# Altium schematic sheet 100_POWER_AND LOADS.SchDoc
size A; SheetNumber: 2; SheetTotal: 4
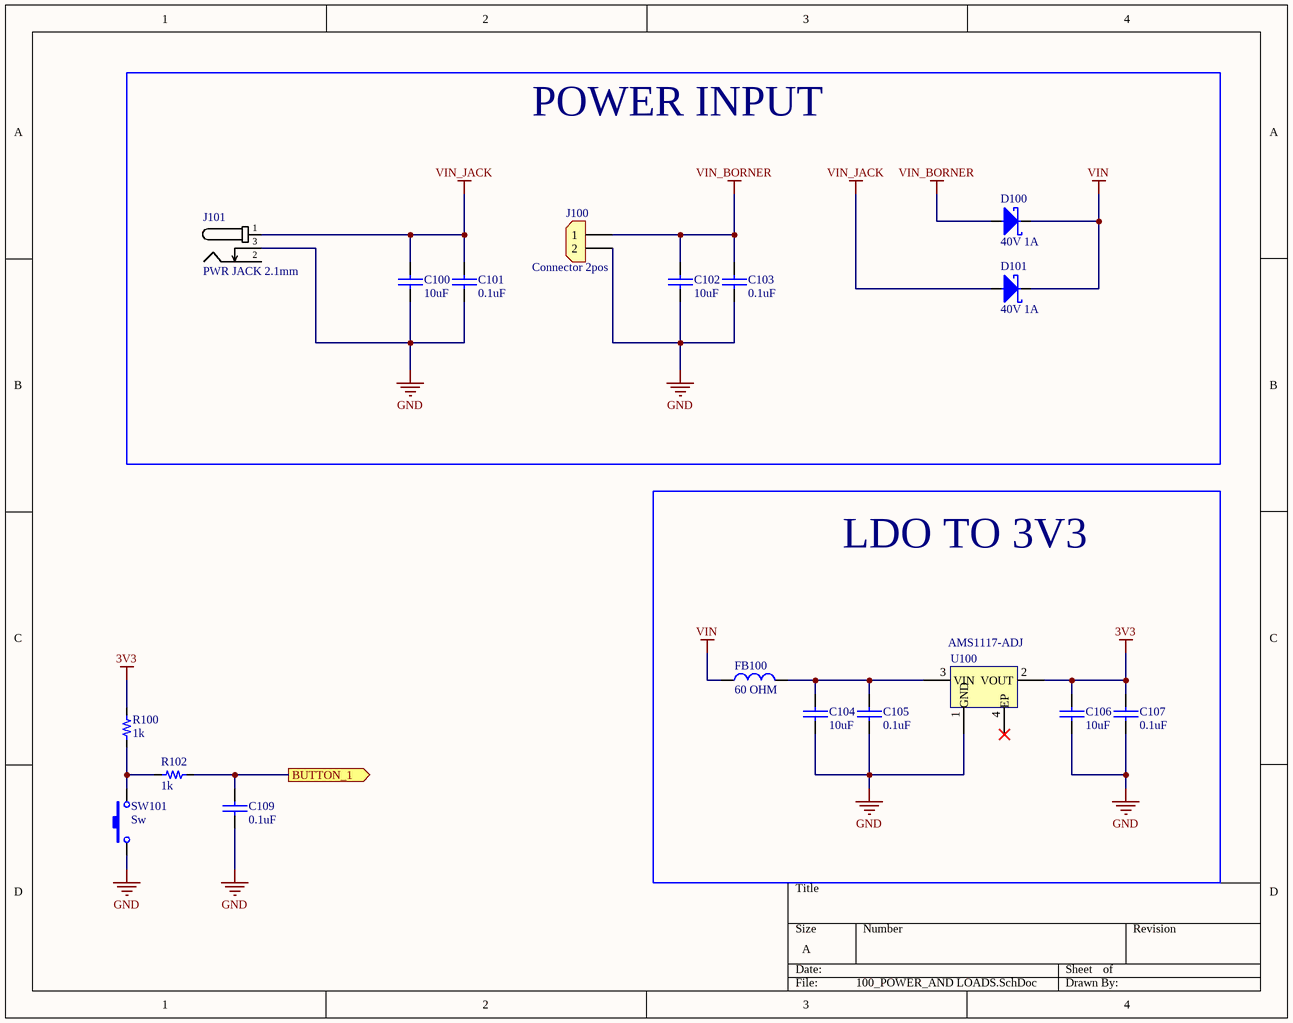
[diagram p0: 100_POWER_AND LOADS.SchDoc]

## Parts
C100  value 10uF  [0603_cap]  (hidden comment: 10uF 10V)
C101  value 0.1uF  [0603_cap]  (hidden comment: 0.1uF 50V)
C102  value 10uF  [0603_cap]  (hidden comment: 10uF 10V)
C103  value 0.1uF  [0603_cap]  (hidden comment: 0.1uF 50V)
C104  value 10uF  [0603_cap]  (hidden comment: 10uF 10V)
C105  value 0.1uF  [0603_cap]  (hidden comment: 0.1uF 50V)
C106  value 10uF  [0603_cap]  (hidden comment: 10uF 10V)
C107  value 0.1uF  [0603_cap]  (hidden comment: 0.1uF 50V)
C109  value 0.1uF  [0603_cap]  (hidden comment: 0.1uF 50V)
D100  40V 1A  [SOD_123]
D101  40V 1A  [SOD_123]
FB100  value 60 OHM  [0603_fb]  (hidden comment: 60OHM 2A)
J100  Connector 2pos  [CON_2x1_TH_5MM]
J101  PWR JACK 2.1mm  [CON_POWER_BARREL_2.1MM_3CONN]
R100  value 1k  [0603_res]  (hidden comment: 1k 1/10W)
R102  value 1k  [0603_res]  (hidden comment: 1k 1/10W)
SW101  Sw  [Sw_PUSH_4.5x4.5x5mm]
U100  AMS1117-ADJ  [SOT_223]

## Blocks framed on the sheet
POWER INPUT: C100-C103 D100 D101 J100 J101
LDO TO 3V3: C104-C107 FB100 U100

## Ports
BUTTON_1 (out, see Main[2B], 000_MCU[2C])

## Nets
3V3: C106.1 C107.1 R100.1 U100.2(VOUT)
GND: C100.2 C101.2 C102.2 C103.2 C104.2 C105.2 C106.2 C107.2 C109.2 J100.2 J101.3 SW101.1 U100.1(GND)
VIN: D100.1 D101.1 FB100.1
VIN_BORNER: C102.1 C103.1 D100.2 J100.1
VIN_JACK: C100.1 C101.1 D101.2 J101.1
BUTTON_1: C109.1 R102.2 ; port BUTTON_1
NetC104_1: C104.1 C105.1 FB100.2 U100.3(VIN)
NetR100_2: R100.2 R102.1 SW101.2

Not connected (* = marked no-connect by the designer): J101 2; U100 4(EP)*

## Library data of the parts
C100 C102 C104 C106 = Cap_10uF_0603_10V: 10V 10uF X5R ±10% 0603 Multilayer Ceramic Capacitors MLCC - SMD/SMT ROHS; Manufacturer: CCTC; Manufacturer Part Number: TCC0603X5R106K100CT; Supplier 1: LCSC; Supplier Part Number 1: C380314; ComponentLink1Description: LCSC; ComponentLink1URL: https://www.lcsc.com/product-detail/Multilayer-Ceramic-Capacitors-MLCC-SMD-SMT_CCTC-TCC0603X5R106K100CT_C380314.html
C101 C103 C105 C107 = Cap_0.1uF_0603_50V: 50V 100nF Y5V -20%~+80% 0603 Multilayer Ceramic Capacitors MLCC - SMD/SMT ROHS; Manufacturer: Walsin Tech Corp; Manufacturer Part Number: 0603F104Z500CT; Supplier 1: LCSC; Supplier Part Number 1: C83060; ComponentLink1Description: LCSC; ComponentLink1URL: https://www.lcsc.com/product-detail/Multilayer-Ceramic-Capacitors-MLCC-SMD-SMT_Walsin-Tech-Corp-0603F104Z500CT_C83060.html
C109 = Cap_0.1uF_0603_50V: 50V 100nF Y5V -20%~+80% 0603 Multilayer Ceramic Capacitors MLCC - SMD/SMT ROHS; Manufacturer: Walsin Tech Corp; Manufacturer Part Number: 0603F104Z500CT; Usage: NM; Supplier 1: LCSC; Supplier Part Number 1: C83060; ComponentLink1Description: LCSC; ComponentLink1URL: https://www.lcsc.com/product-detail/Multilayer-Ceramic-Capacitors-MLCC-SMD-SMT_Walsin-Tech-Corp-0603F104Z500CT_C83060.html
D100 D101 = D_Schottky_40V_1A_SOD_123F: DIODE SCHOTTKY 40V 1A SOD123F; Manufacturer: Shanghai Prisemi Elec; Manufacturer Part Number: PSBD1DF40V1H; Supplier 1: LCSC; Supplier Part Number 1: C110730; ComponentLink1Description: LCSC; ComponentLink1URL: https://www.lcsc.com/product-detail/Switching-Diode_Shanghai-Prisemi-Elec-PSBD1DF40V1H_C110730.html
FB100 = FB_60_0603_2A: 2A 1 100mΩ 60Ω@100MHz ±25% 0603 Ferrite Beads ROHS; Manufacturer: TAI-TECH; Manufacturer Part Number: HCB1608KF-600T20; ComponentLink1Description: LCSC; ComponentLink1URL: https://www.lcsc.com/product-detail/Ferrite-Beads_TAI-TECH-HCB1608KF-600T20_C369516.html; Supplier 1: LCSC; Supplier Part Number 1: C369516
J100 = Con_2x1_TH_5mm: 2POS 5MM; Manufacturer: JILN; Manufacturer Part Number: JL126-50002G01; Supplier 1: LCSC; Supplier Part Number 1: C394556; ComponentLink1Description: Digi-Key; ComponentLink1URL: https://www.lcsc.com/product-detail/Screw-terminal_JILN-JL126-50002G01_C394556.html
J101 = Con_Power_Jack_2.1mm_3pins: CONN PWR JACK 2X5.5MM SOLDER; Manufacturer: HCTL; Manufacturer Part Number: HC-DC-005-2.0T; Supplier 1: LCSC; Supplier Part Number 1: C3010533; ComponentLink1Description: LCSC; ComponentLink1URL: https://www.lcsc.com/product-detail/AC-DC-Power-Connectors_HCTL-HC-DC-005-2-0T_C3010533.html
R100 R102 = Res_1k_0603_1/10W: RES SMD 1k OHM 5% 1/10W 0603; Manufacturer: FOJAN; Manufacturer Part Number: FRC0603J102 TS; ComponentLink1URL: https://www.lcsc.com/product-detail/Chip-Resistor-Surface-Mount_FOJAN-FRC0603J102-TS_C2907113.html; Supplier 1: LCSC; Supplier Part Number 1: C2907113; ComponentLink1Description: LCSC
SW101 = Sw_PUSH_4.5x4.5x5.0xmm: SWITCH TACTILE SPST-NO 0.05A 12V; Manufacturer: BZCN; Manufacturer Part Number: TSC015A05026A; Supplier 1: LCSC; Supplier Part Number 1: C2888509; Last modified by: N-A.Potosi; Last modified date: 20190222; ComponentLink1Description: LCSC; ComponentLink1URL: https://www.lcsc.com/product-detail/Tactile-Switches_BZCN-TSC015A05026A_C2888509.html
U100 = LDO_3V3_1A: 1A 70dB@(120Hz) 5mA 1.2V@1A Adjustable 1.2V~20V Positive 1 20V Output Adjustable SOT-223-3L Linear Voltage Regulators (LDO) ROHS; Manufacturer: WPMtek(Wei Pan Microelectronics); ComponentLink1Description: LCSC; ComponentLink1URL: https://www.lcsc.com/product-detail/Linear-Voltage-Regulators-LDO_WPMtek-Wei-Pan-Microelectronics-AMS1117-ADJ_C2688238.html; Supplier: LCSC; Manufacturer Part Number: AMS1117-ADJ; Supplier Part Number: C2688238